# Altium project Sampling_Scope.PrjPcb (part 1 of 4)
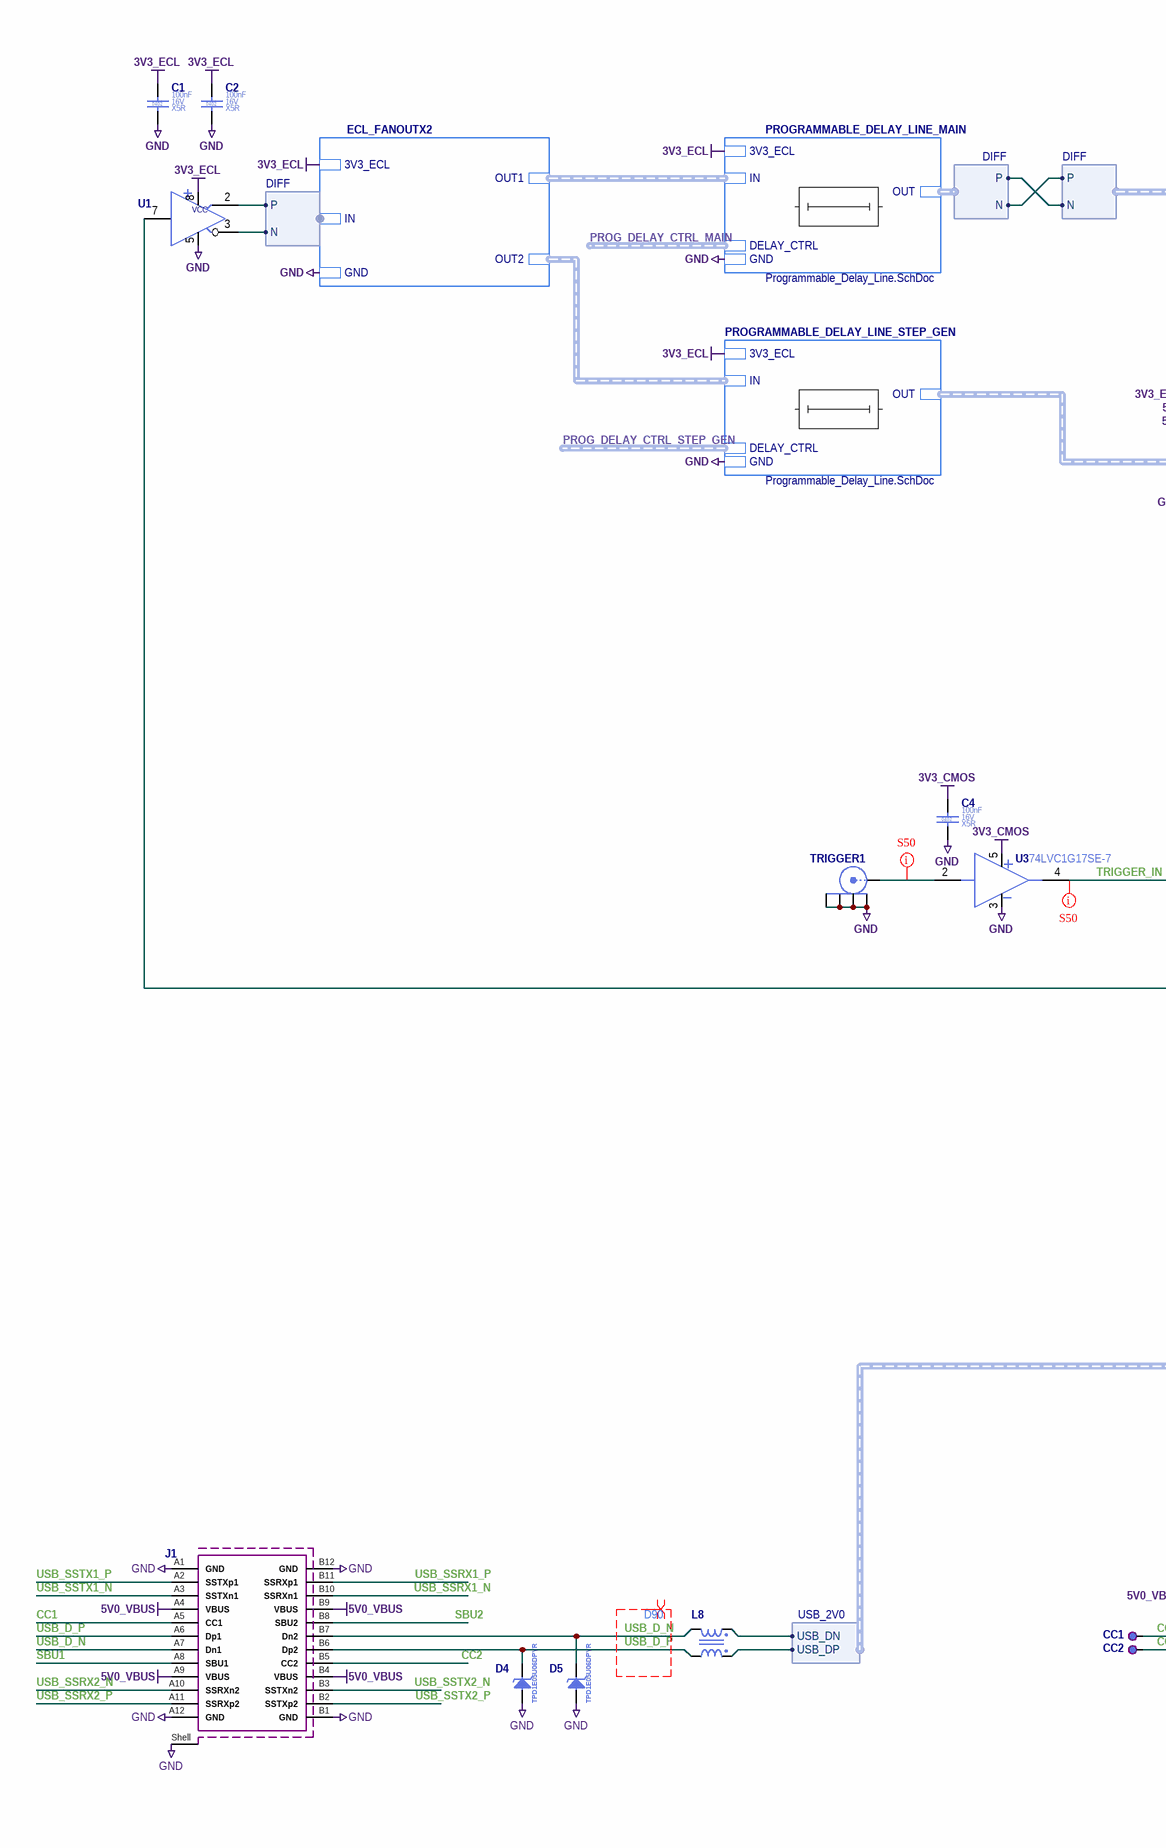
[diagram p0: Main.SchDoc, left]
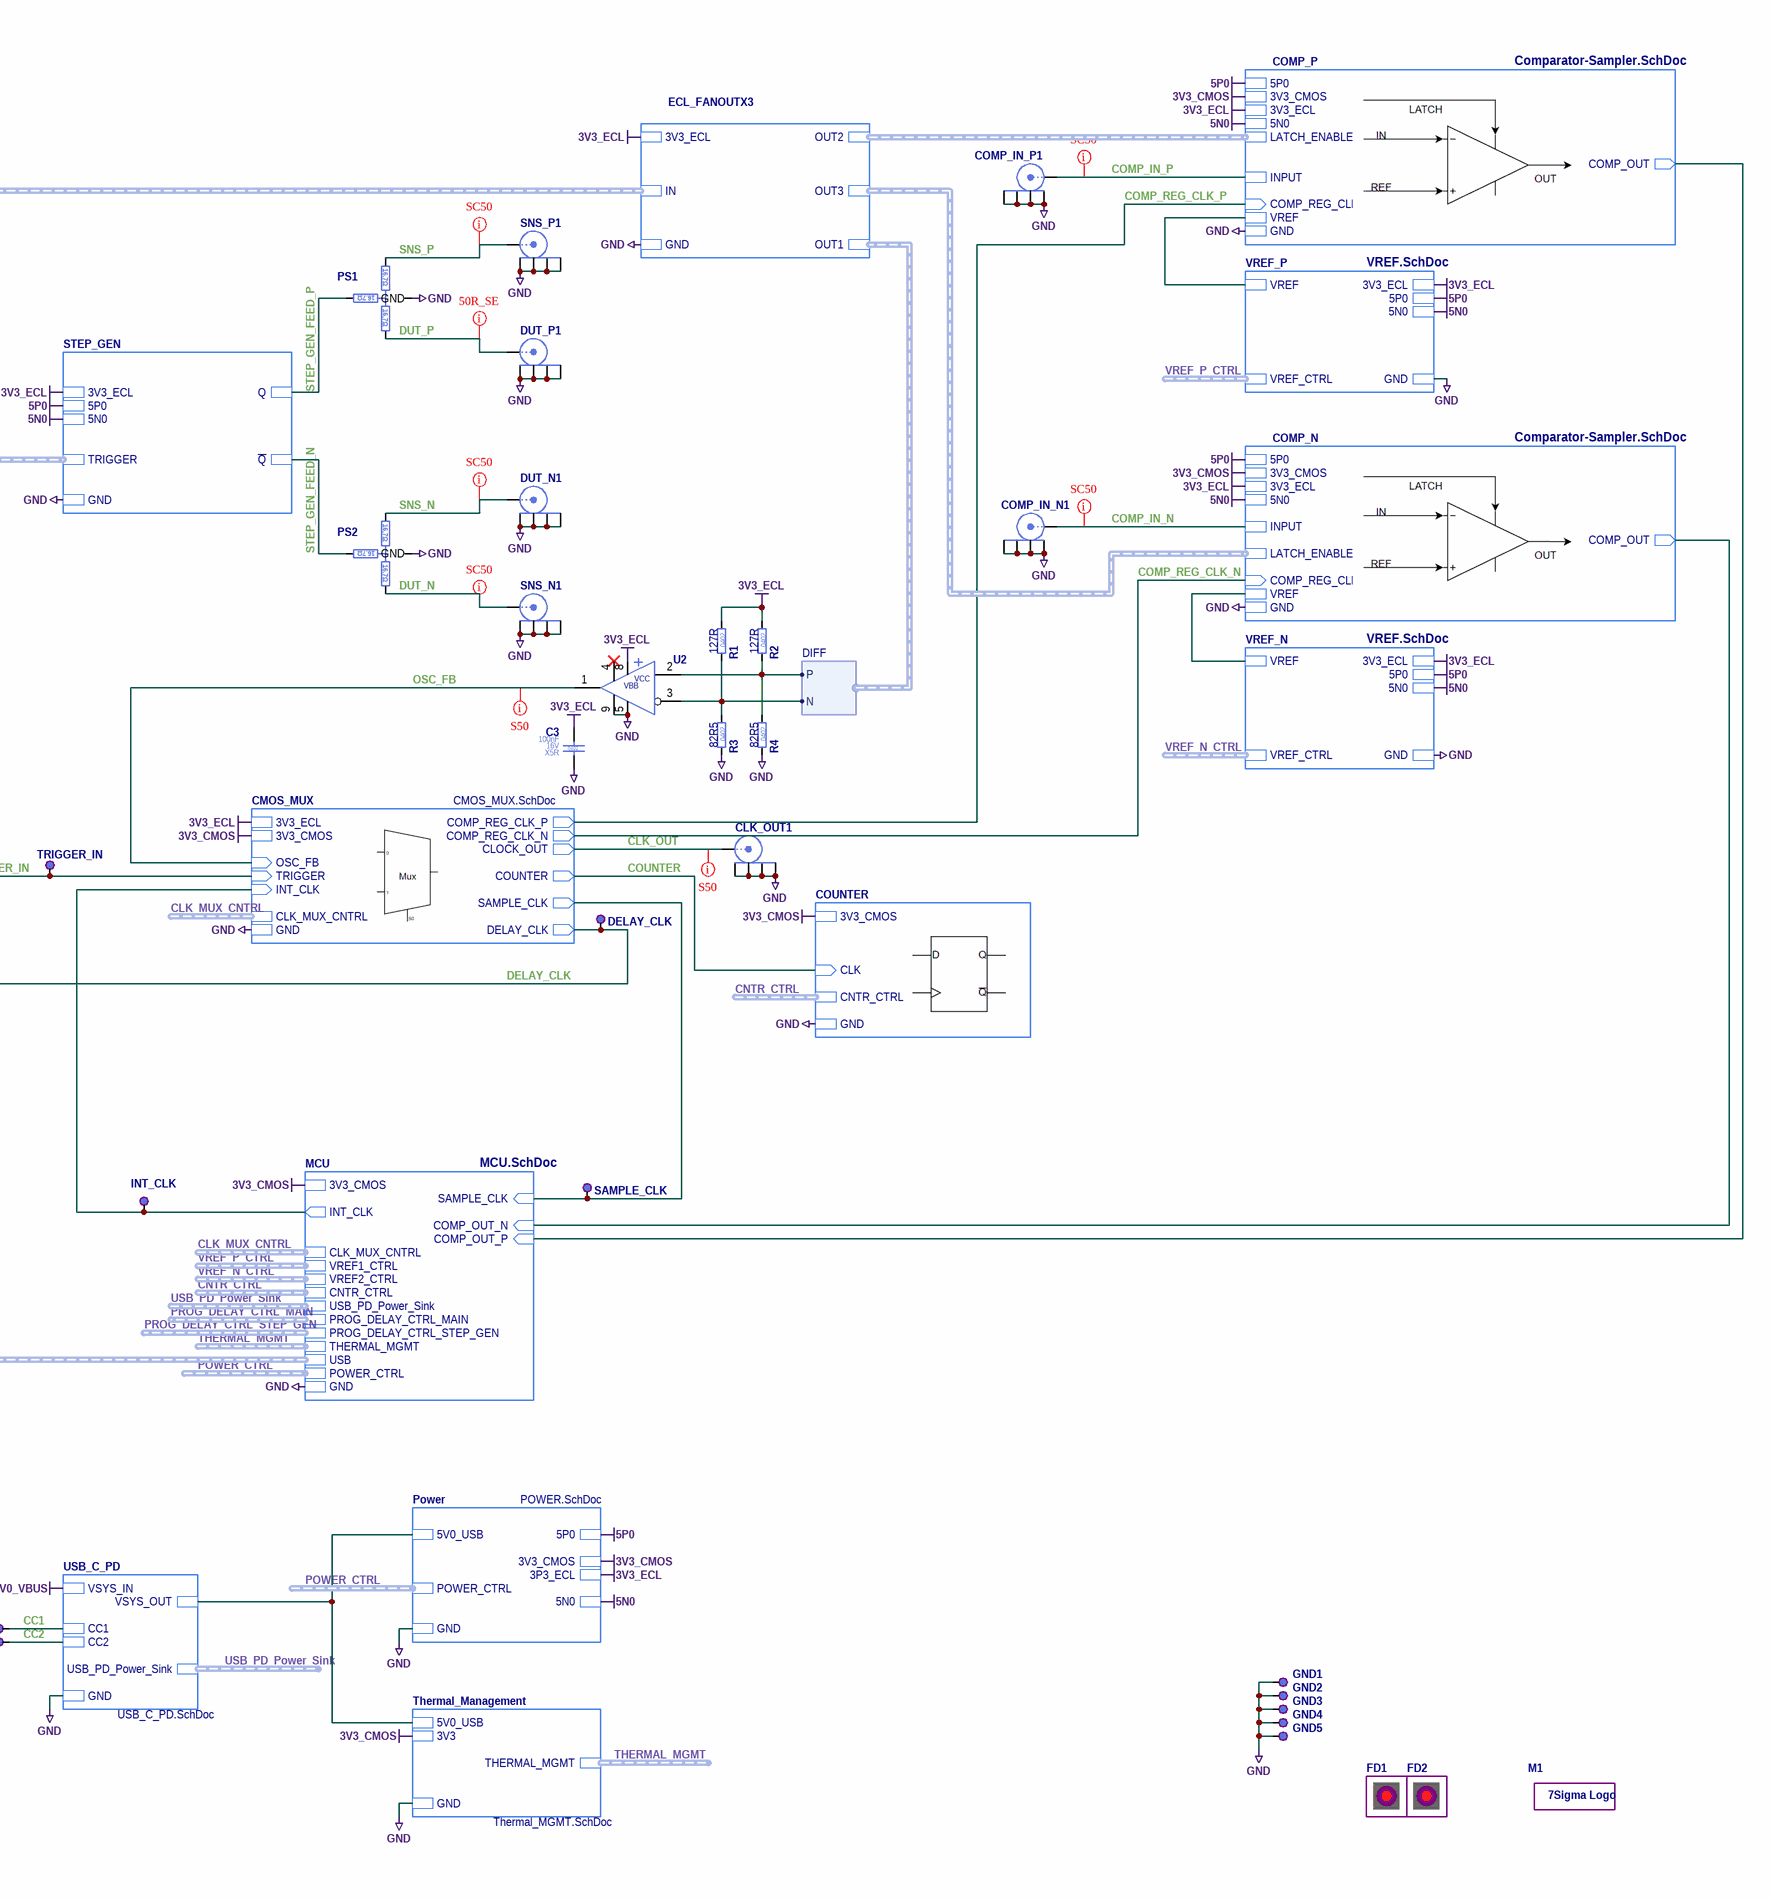
[diagram p1: Main.SchDoc, right]
17 sheets, 475 parts. Net scope: strictly hierarchical (ports join the sheet entries above them; power ports are local).
Board files: Sampling_Scope.PcbDoc, Sampling_Scope_Panel.PcbDoc
Sheets:
  Main.SchDoc
    VREF_P = VREF.SchDoc
      VREF_DAC = DAC_12bit.SchDoc
    COMP_P = Comparator-Sampler.SchDoc
    MCU = MCU.SchDoc
    Power = POWER.SchDoc
      LDO_ECL = 3V3_LDO.SchDoc
      LDO_CMOS = 3V3_LDO.SchDoc
      BUCK = 3V8_SWITCHER.SchDoc
      SIMO = SIMO_SWITCHER.SchDoc
    PROGRAMMABLE_DELAY_LINE_MAIN = Programmable_Delay_Line.SchDoc
      DELAY_DAC = DAC_12bit.SchDoc
    ECL_FANOUTX3 = ECL_Fanout_X3.SchDoc
    STEP_GEN = Step_Gen.SchDoc
    CMOS_MUX = CMOS_MUX.SchDoc
    COUNTER = Counter.SchDoc
    Thermal_Management = Thermal_MGMT.SchDoc
    VREF_N = VREF.SchDoc
      VREF_DAC = DAC_12bit.SchDoc
    COMP_N = Comparator-Sampler.SchDoc
    ECL_FANOUTX2 = ECL_Fanout_X2.SchDoc
    PROGRAMMABLE_DELAY_LINE_STEP_GEN = Programmable_Delay_Line.SchDoc
      DELAY_DAC = DAC_12bit.SchDoc
    USB_C_PD = USB_C_PD.SchDoc

## Sheet Main.SchDoc
size A2; ApprovedBy: Mateusz Kowalik; CheckedBy: Mateusz Kowalik; Author: Mateusz Kowalik; CompanyName: InMotion Labs sp. z o.o.; DrawnBy: Mateusz Kowalik; Engineer: Mateusz Kowalik; Organization: InMotion Labs sp. z o.o.; Address1: Rydlówka 5A; Address2: 30-363 Kraków; Address4: Poland; DocumentNumber: 1; Revision: Rev 0; SheetNumber: 1; SheetTotal: 17

### Parts
C1  Case/Package: 0402  Voltage Rating (DC): 16V  Dielectric: X5R  Capacitance: 100nF  [C_0402_1005]  (hidden comment: C_100NF_16V_X5R_0402_10)
C2  Case/Package: 0402  Voltage Rating (DC): 16V  Dielectric: X5R  Capacitance: 100nF  [C_0402_1005]  (hidden comment: C_100NF_16V_X5R_0402_10)
C3  Case/Package: 0402  Voltage Rating (DC): 16V  Dielectric: X5R  Capacitance: 100nF  [C_0402_1005]  (hidden comment: C_100NF_16V_X5R_0402_10)
C4  Case/Package: 0402  Voltage Rating (DC): 16V  Dielectric: X5R  Capacitance: 100nF  [C_0402_1005]  (hidden comment: C_100NF_16V_X5R_0402_10)
CC1  TP_PAD_1.3MM  [TP_PAD_1.3MM]  (value not drawn)  (no BOM)
CC2  TP_PAD_1.3MM  [TP_PAD_1.3MM]  (value not drawn)  (no BOM)
CLK_OUT1  60312202111527  [60312202111527]  (value not drawn)
COMP_IN_N1  60312202111527  [60312202111527]  (value not drawn)
COMP_IN_P1  60312202111527  [60312202111527]  (value not drawn)
D4  TPD1E05U06DPYR  [DFN100X60X40-2N]
D5  TPD1E05U06DPYR  [DFN100X60X40-2N]
DELAY_CLK  TP_PAD_1.3MM  [TP_PAD_1.3MM]  (value not drawn)  (no BOM)
DUT_N1  60312202111527  [60312202111527]  (value not drawn)
DUT_P1  60312202111527  [60312202111527]  (value not drawn)
FD1  FIDUCIAL  [FID]  (value not drawn)  (no BOM)
FD2  FIDUCIAL  [FID]  (value not drawn)  (no BOM)
GND1  5016  [5016]  (value not drawn)  (no BOM)
GND2  5016  [5016]  (value not drawn)  (no BOM)
GND3  5016  [5016]  (value not drawn)  (no BOM)
GND4  5016  [5016]  (value not drawn)  (no BOM)
GND5  5016  [5016]  (value not drawn)  (no BOM)
INT_CLK  TP_PAD_1.3MM  [TP_PAD_1.3MM]  (value not drawn)  (no BOM)
J1  632723100011  [632723100011]  (value not drawn)
L8  744231091  [L_0805_COMMON_MODE]  (value not drawn)
M1  7Sigma  [7Sigma]  (value not drawn)  (no BOM)
PS1  PS1608GT2-R50-T1  [PS1608G]  (value not drawn)
PS2  PS1608GT2-R50-T1  [PS1608G]  (value not drawn)
R1  Resistance: 127R  Case/Package: 0402  [R_0402_1005]  (hidden comment: R_127R_0402_1)
R2  Resistance: 127R  Case/Package: 0402  [R_0402_1005]  (hidden comment: R_127R_0402_1)
R3  Resistance: 82R5  Case/Package: 0402  [R_0402_1005]  (hidden comment: R_82R5_0402_1)
R4  Resistance: 82R5  Case/Package: 0402  [R_0402_1005]  (hidden comment: R_82R5_0402_1)
SAMPLE_CLK  TP_PAD_1.3MM  [TP_PAD_1.3MM]  (value not drawn)  (no BOM)
SNS_N1  60312202111527  [60312202111527]  (value not drawn)
SNS_P1  60312202111527  [60312202111527]  (value not drawn)
TRIGGER1  60312202111527  [60312202111527]  (value not drawn)
TRIGGER_IN  TP_PAD_1.3MM  [TP_PAD_1.3MM]  (value not drawn)  (no BOM)
U1  MC100LVELT20DG  [SOIC127P600X170-8N]  (value not drawn)
U2  MC100EPT21MNR4G  [SON50P200X80_HS-9N]  (value not drawn)
U3  74LVC1G17SE-7  [SC70-5_SOT353_TSSOP5]

### Sub-sheets
CMOS_MUX = CMOS_MUX.SchDoc: 3V3_ECL, INT_CLK (in), CLK_MUX_CNTRL (harness CLK_MUX_CTRL), SAMPLE_CLK (out), 3V3_CMOS, CLOCK_OUT (out), GND, OSC_FB (in), DELAY_CLK (out), TRIGGER (in), COMP_REG_CLK_P (out), COUNTER (out), COMP_REG_CLK_N (out)
COMP_N = Comparator-Sampler.SchDoc: INPUT, COMP_OUT (out), VREF, LATCH_ENABLE (harness DIFF), 5N0, 3V3_ECL, GND, 3V3_CMOS, 5P0, COMP_REG_CLK (in)
COMP_P = Comparator-Sampler.SchDoc: INPUT, COMP_OUT (out), VREF, LATCH_ENABLE (harness DIFF), 5N0, 3V3_ECL, GND, 3V3_CMOS, 5P0, COMP_REG_CLK (in)
COUNTER = Counter.SchDoc: CLK (in), GND, CNTR_CTRL (harness CNTR_CTRL), 3V3_CMOS
ECL_FANOUTX2 = ECL_Fanout_X2.SchDoc: GND, 3V3_ECL, IN (harness DIFF), OUT1 (harness DIFF), OUT2 (harness DIFF)
ECL_FANOUTX3 = ECL_Fanout_X3.SchDoc: GND, 3V3_ECL, OUT3 (harness DIFF), IN (harness DIFF), OUT1 (harness DIFF), OUT2 (harness DIFF)
MCU = MCU.SchDoc: COMP_OUT_P (in), SAMPLE_CLK (in), INT_CLK (out), 3V3_CMOS, GND, CLK_MUX_CNTRL (harness CLK_MUX_CTRL), VREF1_CTRL (harness DAC), CNTR_CTRL, VREF2_CTRL (harness DAC), COMP_OUT_N (in), PROG_DELAY_CTRL_MAIN, PROG_DELAY_CTRL_STEP_GEN, THERMAL_MGMT, USB (harness USB_2V0), POWER_CTRL (harness POWER_CTRL), USB_PD_Power_Sink
Power = POWER.SchDoc: 3P3_ECL, 3V3_CMOS, GND, 5N0, 5V0_USB, 5P0, POWER_CTRL
PROGRAMMABLE_DELAY_LINE_MAIN = Programmable_Delay_Line.SchDoc: DELAY_CTRL (harness DELAY), GND, IN (harness DIFF), 3V3_ECL, OUT (harness DIFF)
PROGRAMMABLE_DELAY_LINE_STEP_GEN = Programmable_Delay_Line.SchDoc: DELAY_CTRL (harness DELAY), GND, IN (harness DIFF), 3V3_ECL, OUT (harness DIFF)
STEP_GEN = Step_Gen.SchDoc: GND, 3V3_ECL, TRIGGER (harness DIFF), 5N0, 5P0, ~{Q}, Q
Thermal_Management = Thermal_MGMT.SchDoc: 5V0_USB, GND, 3V3, THERMAL_MGMT (harness THERMAL_MGMT)
USB_C_PD = USB_C_PD.SchDoc: CC2, VSYS_OUT, VSYS_IN, GND, CC1, USB_PD_Power_Sink (harness USB_PD_Power_Sink)
VREF_N = VREF.SchDoc: VREF_CTRL (harness DAC), VREF, 3V3_ECL, 5N0, GND, 5P0
VREF_P = VREF.SchDoc: VREF_CTRL (harness DAC), VREF, 3V3_ECL, 5N0, GND, 5P0

### Harnesses
DIFF: P, N
USB_2V0: USB_DN, USB_DP

### Nets
3V3_CMOS: C4.1 U3.5(VCC) ; sheet COMP_P/3V3_CMOS, sheet MCU/3V3_CMOS, sheet Power/3V3_CMOS, sheet CMOS_MUX/3V3_CMOS, sheet COUNTER/3V3_CMOS, sheet Thermal_Management/3V3, sheet COMP_N/3V3_CMOS
3V3_ECL: C1.1 C2.1 C3.1 R1.2 R2.2 U1.8(VCC) U2.8(VDD) ; sheet VREF_P/3V3_ECL, sheet COMP_P/3V3_ECL, sheet Power/3P3_ECL, sheet PROGRAMMABLE_DELAY_LINE_MAIN/3V3_ECL, sheet ECL_FANOUTX3/3V3_ECL, sheet STEP_GEN/3V3_ECL, sheet CMOS_MUX/3V3_ECL, sheet VREF_N/3V3_ECL, sheet COMP_N/3V3_ECL, sheet ECL_FANOUTX2/3V3_ECL, sheet PROGRAMMABLE_DELAY_LINE_STEP_GEN/3V3_ECL
5N0: sheet VREF_P/5N0, sheet COMP_P/5N0, sheet Power/5N0, sheet STEP_GEN/5N0, sheet VREF_N/5N0, sheet COMP_N/5N0
5P0: sheet VREF_P/5P0, sheet COMP_P/5P0, sheet Power/5P0, sheet STEP_GEN/5P0, sheet VREF_N/5P0, sheet COMP_N/5P0
5V0_USB: sheet Power/5V0_USB, sheet Thermal_Management/5V0_USB, sheet USB_C_PD/VSYS_OUT
5V0_VBUS: J1.A4(VBUS) J1.A9(VBUS) J1.B4(VBUS) J1.B9(VBUS) ; sheet USB_C_PD/VSYS_IN
GND: C1.2 C2.2 C3.2 C4.2 CLK_OUT1.2(Y) CLK_OUT1.3(Y) CLK_OUT1.4(Y) CLK_OUT1.5(Y) COMP_IN_N1.2(Y) COMP_IN_N1.3(Y) COMP_IN_N1.4(Y) COMP_IN_N1.5(Y) COMP_IN_P1.2(Y) COMP_IN_P1.3(Y) COMP_IN_P1.4(Y) COMP_IN_P1.5(Y) D4.2(A) D5.2(A) DUT_N1.2(Y) DUT_N1.3(Y) DUT_N1.4(Y) DUT_N1.5(Y) DUT_P1.2(Y) DUT_P1.3(Y) DUT_P1.4(Y) DUT_P1.5(Y) GND1.1(TP) GND2.1(TP) GND3.1(TP) GND4.1(TP) GND5.1(TP) J1.A1(GND) J1.A12(GND) J1.B1(GND) J1.B12(GND) J1.Shell(Shield) PS1.4(GND) PS2.4(GND) R3.1 R4.1 SNS_N1.2(Y) SNS_N1.3(Y) SNS_N1.4(Y) SNS_N1.5(Y) SNS_P1.2(Y) SNS_P1.3(Y) SNS_P1.4(Y) SNS_P1.5(Y) TRIGGER1.2(Y) TRIGGER1.3(Y) TRIGGER1.4(Y) TRIGGER1.5(Y) U1.5(VSS) U2.5(VSS) U2.9(VSS) U3.3(GND) ; sheet VREF_P/GND, sheet COMP_P/GND, sheet MCU/GND, sheet Power/GND, sheet PROGRAMMABLE_DELAY_LINE_MAIN/GND, sheet ECL_FANOUTX3/GND, sheet STEP_GEN/GND, sheet CMOS_MUX/GND, sheet COUNTER/GND, sheet Thermal_Management/GND, sheet VREF_N/GND, sheet COMP_N/GND, sheet ECL_FANOUTX2/GND, sheet PROGRAMMABLE_DELAY_LINE_STEP_GEN/GND, sheet USB_C_PD/GND
CC1: CC1.1(TP) J1.A5(CC1) ; sheet USB_C_PD/CC1
CC2: CC2.1(TP) J1.B5(CC2) ; sheet USB_C_PD/CC2
CLK_OUT: CLK_OUT1.1(X) ; sheet CMOS_MUX/CLOCK_OUT
COMP_IN_N: COMP_IN_N1.1(X) ; sheet COMP_N/INPUT
COMP_IN_P: COMP_IN_P1.1(X) ; sheet COMP_P/INPUT
COMP_OUT_N: sheet COMP_P/COMP_OUT, sheet MCU/COMP_OUT_P
COMP_OUT_P: sheet MCU/COMP_OUT_N, sheet COMP_N/COMP_OUT
COMP_REG_CLK_N: sheet CMOS_MUX/COMP_REG_CLK_N, sheet COMP_N/COMP_REG_CLK
COMP_REG_CLK_P: sheet COMP_P/COMP_REG_CLK, sheet CMOS_MUX/COMP_REG_CLK_P
COUNTER: sheet CMOS_MUX/COUNTER, sheet COUNTER/CLK
DELAY_CLK: DELAY_CLK.1(TP) U1.7(D) ; sheet CMOS_MUX/DELAY_CLK
DELAY_OUT1_N: sheet PROGRAMMABLE_DELAY_LINE_MAIN/OUT.N, sheet ECL_FANOUTX3/IN.P
DELAY_OUT1_P: sheet PROGRAMMABLE_DELAY_LINE_MAIN/OUT.P, sheet ECL_FANOUTX3/IN.N
DUT_N: PS2.3(OUT2) SNS_N1.1(X)  [project net DUT_N_1]
DUT_P: DUT_P1.1(X) PS1.3(OUT2)  [project net DUT_P_1]
IN_N: U1.3(~{Q}) ; sheet ECL_FANOUTX2/IN.N
IN_P: U1.2(Q) ; sheet ECL_FANOUTX2/IN.P
INT_CLK: INT_CLK.1(TP) ; sheet MCU/INT_CLK, sheet CMOS_MUX/INT_CLK
OSC_FB: U2.1(OUTA) ; sheet CMOS_MUX/OSC_FB
OUT1_N: R1.1 R3.2 U2.3(~{D}) ; sheet ECL_FANOUTX3/OUT1.N
OUT1_P: R2.1 R4.2 U2.2(D) ; sheet ECL_FANOUTX3/OUT1.P
SAMPLE_CLK: SAMPLE_CLK.1(TP) ; sheet MCU/SAMPLE_CLK, sheet CMOS_MUX/SAMPLE_CLK
SBU1: J1.A8(SBU1)  [project net SBU1_1]
SBU2: J1.B8(SBU2)  [project net SBU2_1]
SNS_N: DUT_N1.1(X) PS2.2(OUT1)  [project net SNS_N_1]
SNS_P: PS1.2(OUT1) SNS_P1.1(X)  [project net SNS_P_1]
STEP_GEN_FEED_N: PS2.1(IN) ; sheet STEP_GEN/~{Q}
STEP_GEN_FEED_P: PS1.1(IN) ; sheet STEP_GEN/Q
TRIGGER_IN: TRIGGER_IN.1(TP) U3.4(Y) ; sheet CMOS_MUX/TRIGGER
USB_D_N: D5.1(C) J1.A7(Dn1) J1.B7(Dn2) L8.2  [project net USB_D_N_1]
USB_D_N: L8.1 ; sheet MCU/USB.USB_DN  [a separate net that carries the same name]
USB_D_P: D4.1(C) J1.A6(Dp1) J1.B6(Dp2) L8.3  [project net USB_D_P_1]
USB_D_P: L8.4 ; sheet MCU/USB.USB_DP  [a separate net that carries the same name]
USB_SSRX1_N: J1.B10(SSRXn1)  [project net USB_SSRX1_N_1]
USB_SSRX1_P: J1.B11(SSRXp1)  [project net USB_SSRX1_P_1]
USB_SSRX2_N: J1.A10(SSRXn2)  [project net USB_SSRX2_N_1]
USB_SSRX2_P: J1.A11(SSRXp2)  [project net USB_SSRX2_P_1]
USB_SSTX1_N: J1.A3(SSTXn1)  [project net USB_SSTX1_N_1]
USB_SSTX1_P: J1.A2(SSTXp1)  [project net USB_SSTX1_P_1]
USB_SSTX2_N: J1.B3(SSTXn2)  [project net USB_SSTX2_N_1]
USB_SSTX2_P: J1.B2(SSTXp2)  [project net USB_SSTX2_P_1]
NetC8_COMP_N_1: sheet VREF_N/VREF, sheet COMP_N/VREF
NetC8_COMP_P_1: sheet VREF_P/VREF, sheet COMP_P/VREF
NetTRIGGER1_1: TRIGGER1.1(X) U3.2(A)

Not connected (* = marked no-connect by the designer): U1 1(NC) 4(NC) 6(NC); U2 4(VDD)*

### Buses and harness runs
harness CLK_MUX_CNTRL = sheet CMOS_MUX/CLK_MUX_CNTRL
harness CLK_MUX_CNTRL = sheet MCU/CLK_MUX_CNTRL
harness CNTR_CTRL = sheet COUNTER/CNTR_CTRL
harness CNTR_CTRL = sheet MCU/CNTR_CTRL
harness POWER_CTRL = sheet MCU/POWER_CTRL
harness POWER_CTRL = sheet Power/POWER_CTRL
harness PROG_DELAY_CTRL_MAIN = sheet MCU/PROG_DELAY_CTRL_MAIN
harness PROG_DELAY_CTRL_MAIN = sheet PROGRAMMABLE_DELAY_LINE_MAIN/DELAY_CTRL
harness PROG_DELAY_CTRL_STEP_GEN = sheet MCU/PROG_DELAY_CTRL_STEP_GEN
harness PROG_DELAY_CTRL_STEP_GEN = sheet PROGRAMMABLE_DELAY_LINE_STEP_GEN/DELAY_CTRL
harness sheet COMP_N/LATCH_ENABLE = sheet ECL_FANOUTX3/OUT3
harness sheet COMP_P/LATCH_ENABLE = sheet ECL_FANOUTX3/OUT2
harness sheet ECL_FANOUTX2/OUT1 = sheet PROGRAMMABLE_DELAY_LINE_MAIN/IN
harness sheet ECL_FANOUTX2/OUT2 = sheet PROGRAMMABLE_DELAY_LINE_STEP_GEN/IN
harness sheet PROGRAMMABLE_DELAY_LINE_STEP_GEN/OUT = sheet STEP_GEN/TRIGGER
harness THERMAL_MGMT = sheet MCU/THERMAL_MGMT
harness THERMAL_MGMT = sheet Thermal_Management/THERMAL_MGMT
harness USB_PD_Power_Sink = sheet MCU/USB_PD_Power_Sink
harness USB_PD_Power_Sink = sheet USB_C_PD/USB_PD_Power_Sink
harness VREF_N_CTRL = sheet MCU/VREF2_CTRL
harness VREF_N_CTRL = sheet VREF_N/VREF_CTRL
harness VREF_P_CTRL = sheet MCU/VREF1_CTRL
harness VREF_P_CTRL = sheet VREF_P/VREF_CTRL

### Layout directives
net class SC50: DUT_N_1, DUT_P_1, SNS_N_1, SNS_P_1
net class S50: CLK_OUT, NetTRIGGER1_1, OSC_FB, TRIGGER_IN
net class SC50; net class COMP_IN: COMP_IN_N, COMP_IN_P
differential pair; differential pair class D90: USB_D_N, USB_D_P

### Notes on the sheet
- Title
- Size:
- Date:
- A2
- (in symbol 7Sigma) 7Sigma Logo
- (in symbol MC100EPT21MNR4G) VCC; VBB
- (in symbol PS1608GT2-R50-T1) 16.7Ω

### Library data of the parts
C1-C4 = C_100NF_16V_X5R_0402_10: Ceramic Capacitor; Manufacturer Part Number: EMK105BJ104KV-F; Manufacturer: Taiyo Yuden; Value: 100nF; Tolerance: 10%; Part Number: C_100NF_16V_X5R_0402_10; Mount: Surface Mount; Height: 500um; HelpURL: http://datasheet.octopart.com/EMK105BJ104KV-F-Taiyo-Yuden-datasheet-8857305.pdf; RoHS: Compliant; Max Operating Temperature: 125°C; Status: MK; Supplier 1: Mouser; Supplier Part Number 1: 963-EMK105BJ104KV-F; Manufacturer 2: Samsung Electro-Mechanics; Manufacturer Part Number 2: CL05B104KO5NNNC; Supplier 2: LCSC; Supplier Part Number 2: C1525
CC1 CC2 DELAY_CLK INT_CLK SAMPLE_CLK TRIGGER_IN = TP_PAD_1.3MM: Testpoint SMD 1.3mm; Part Number: TP_PAD_1.3MM; Case/Package: SMD; Length: 0mm
CLK_OUT1 COMP_IN_N1 COMP_IN_P1 DUT_N1 DUT_P1 SNS_N1 SNS_P1 TRIGGER1 = 60312202111527: SMA Connector; Manufacturer: Wurth Electronics; Gender: Female; Max Frequency: 18GHz; Box: T1; Manufacturer Part Number: 60312202111527; Part Number: 60312202111527; Mount: SMD; Height: 6.35mm; HelpURL: https://www.we-online.com/catalog/datasheet/60312202111527.pdf; Lead Free: Lead Free; Length: 13.33mm; Number of Pins: 3; Orientation: Vertical; RoHS: Compliant; Stock: 3
D4 D5 = TPD1E05U06DPYR: 1 Channel ESD Protection Device for Super-Speed (Up to 6 Gbps); Manufacturer: Texas Instruments; Capacitance: 0.5pF; Max Power Dissipation: 40W; Direction: Unidirectional; Max Breakdown Voltage: 5.5V; Min Breakdown Voltage: 6V; Box: 79; Part Number: TPD1E05U06DPYR; Case/Package: 0402; Manufacturer Part Number: TPD1E05U06DPYR; Mount: Surface Mount; HelpURL: https://www.ti.com/lit/ds/symlink/tpd1e05u06.pdf?ts=1594570399510&ref_url=https%253A%252F%252Fwww.ti.com%252Fproduct%252FTPD1E05U06; Working Voltage: 5.5V; Max Operating Temperature: 125°C; RoHS: Compliant; Height: 0.35mm; Status: MK; Supplier 1: Mouser; Supplier Part Number 1: 595-TPD1E05U06DPYR; Stock: 56
GND1-GND5 = 5016: Test Point; Micro Mini; SMT; Phos Bronze/Silver; Manufacturer: Keystone Electronics; Number of Ports: 1; Part Number: 5016; Case/Package: SMD; Mount: Surface Mount; Height: 0.09inch; HelpURL: https://pl.mouser.com/datasheet/2/215/016-743689.pdf; Lead Free: Lead Free; Length: 3.81mm; Number of Pins: 1; REACH SVHC: No SVHC; RoHS: Compliant; Termination: Solder; Manufacturer Part Number: 5016; Supplier 1: Mouser; Supplier Part Number 1: 534-5016
J1 = 632723100011: WR-COM USB 3.1 Type C Receptacle Horizontal THT / SMT; Manufacturer: Wurth Electronics; Box: G5; Part Number: 632723100011; Manufacturer Part Number: 632723100011; Mount: Surface Mount,Through Hole; Number of Pins: 24; Orientation: Horizontal; HelpURL: https://pl.mouser.com/datasheet/2/445/632723x00011(3)-782157.pdf; Max Operating Temperature: 105C; RoHS: Compilant; Stock: 13
L8 = 744231091: Common Mode Line Filter; Manufacturer: Wurth Elektronik; Inductance: 131nH; DC Current: 370mA; DC Resistance: 300m; Box: 72; Part Number: 744231091; Manufacturer Part Number: 744231091; Case/Package: 0805; Mount: Surface Mount; Height: 1.2mm; HelpURL: https://www.we-online.com/catalog/datasheet/744231091.pdf; Max Operating Temperature: 125; Status: MK; RoHS: Compliant; Stock: 22
M1 = 7Sigma: 7Sigma Marking; Part Number: 7Sigma; Status: MK
PS1 PS2 = PS1608GT2-R50-T1: 20GHz Resistive Power Splitter; Manufacturer: Susumu; Impedance: 50Ohm; Manufacturer Part Number: PS1608GT2-R50-T1; Part Number: PS1608GT2-R50-T1; Mount: Surface Mount; Frequency: 20GHz; Height: 400um; HelpURL: https://pl.mouser.com/datasheet/2/392/n_catalog_partition31_en-1660522.pdf; Max Operating Temperature: 125; Min Operating Temperature: -40; Status: MK; RoHS: Compliant
R1 R2 = R_127R_0402_1: Thick Film Resistor; Manufacturer: Yageo; Manufacturer Part Number: RC0402FR-07127RL; Value: 127R; Tolerance: 1%; Voltage Rating (DC): 50V; Power Rating: 63mW; Stats: MK; Part Number: R_127R_0402_1; Mount: Surface Mount; Height: 350um; HelpURL: https://pl.mouser.com/datasheet/2/447/PYu_RC_Group_51_RoHS_L_10-1664068.pdf; RoHS: Compliant; Max Operating Temperature: 155°C; Supplier 1: Mouser; Supplier Part Number 1: 603-RC0402FR-07127RL; Manufacturer 2: Uniroyal Elec; Manufacturer Part Number 2: 0402WGF1270TCE; Supplier 2: LCSC; Supplier Part Number 2: C247127
R3 R4 = R_82R5_0402_1: Thick Film Resistor; Manufacturer: Yageo; Manufacturer Part Number: RC0402FR-0782R5L; Value: 82R5; Tolerance: 1%; Voltage Rating (DC): 50V; Power Rating: 63mW; Stats: MK; Part Number: R_82R5_0402_1; Mount: Surface Mount; Height: 350um; HelpURL: https://pl.mouser.com/datasheet/2/447/PYu-RC_Group_51_RoHS_L_10-1527934.pdf; RoHS: Compliant; Max Operating Temperature: 155°C; Supplier 1: Mouser; Supplier Part Number 1: 603-RC0402FR-0782R5L; Manufacturer 2: Uniroyal Elec; Manufacturer Part Number 2: 0402WGF825JTCE; Supplier 2: LCSC; Supplier Part Number 2: C52037
U1 = MC100LVELT20DG: LVTTL/LVCMOS to Differential LVPECL Translator; Manufacturer: ON Semiconductor; Output Current: 100mA; Marking: KVT20; Max Supply Voltage: 3.6V; Min Supply Voltage: 3V; Part Number: MC100LVELT20DG; Case/Package: SOIC8; Max Output Current: 100mA; Mount: Surface Mount; Height: 1.75mm; HelpURL: https://pl.mouser.com/datasheet/2/308/MC100LVELT20_D-1811115.pdf; Max Operating Temperature: 85°C; RoHS: Compliant; Status: MK; Manufacturer Part Number: MC100LVELT20DG; Supplier 1: Mouser; Supplier Part Number 1: 863-MC100LVELT20DG
U2 = MC100EPT21MNR4G: Differential LVPECL/LVDS/CML to LVTTL/LVCMOS Translator; Manufacturer: ON Semiconductor; Output Current: 24mA; Marking: 3RM; Max Supply Voltage: 3.8V; Min Supply Voltage: 3.3V; Part Number: MC100EPT21MNR4G; Case/Package: DFN-8; Max Output Current: 24mA; Mount: Surface Mount; Height: 1mm; HelpURL: https://datasheet.octopart.com/MC100EPT21MNR4G-ON-Semiconductor-datasheet-12520234.pdf; Max Operating Temperature: 85°C; RoHS: Compliant; Status: MK; Manufacturer Part Number: MC100EPT21MNR4G; Supplier 1: Mouser; Supplier Part Number 1: 863-MC100EPT21MNR4G
U3 = 74LVC1G17SE-7: Schmitt Buffer; Manufacturer: Diodes Incorporated; Output Current: 24mA; Marking: UR; Max Supply Voltage: 5.5V; Min Supply Voltage: 1.65V; Manufacturer Part Number: 74LVC1G17SE-7; Part Number: 74LVC1G17SE-7; Case/Package: SOT-353; Max Output Current: 24mA; Mount: Surface Mount; HelpURL: https://datasheet.octopart.com/74LVC1G17SE-7-Diodes-Inc.-datasheet-46750521.pdf; Max Operating Temperature: 125°C; RoHS: Compliant; Status: MK; Supplier 1: Mouser; Supplier Part Number 1: 621-74LVC1G17SE-7
FD1 FD2 = FIDUCIAL: Part Number: FIDUCIAL; Status: MK

## Sheet VREF.SchDoc
size A4; ApprovedBy: Mateusz Kowalik; CheckedBy: Mateusz Kowalik; Author: Mateusz Kowalik; CompanyName: InMotion Labs sp. z o.o.; DrawnBy: Mateusz Kowalik; Engineer: Mateusz Kowalik; Organization: InMotion Labs sp. z o.o.; Address1: Rydlówka 5A; Address2: 30-363 Kraków; Address4: Poland; DocumentNumber: 11; Revision: Rev 0; SheetNumber: 11; SheetTotal: 17
Used 2 times, as channels VREF_P, VREF_N. Parts and nets are listed once, with the designators drawn on the sheet.
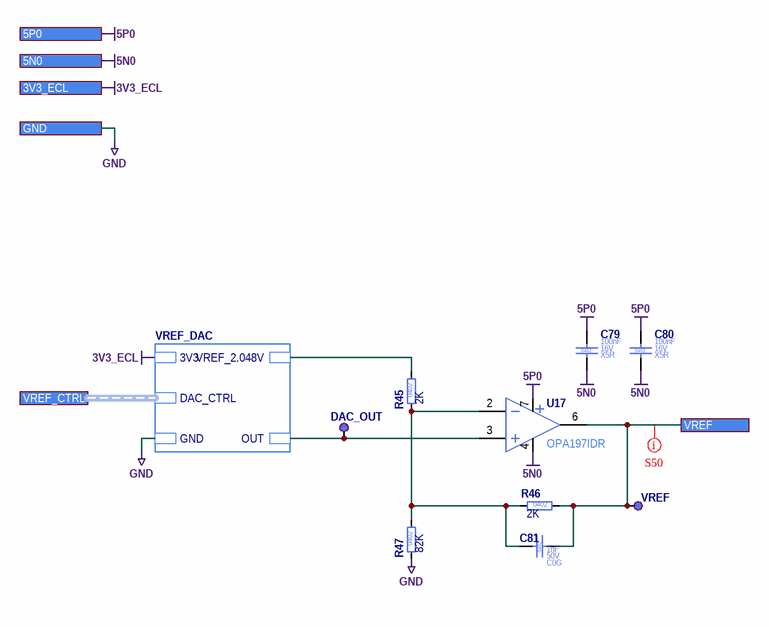
[diagram p2: VREF.SchDoc]

### Parts
C79  Case/Package: 0402  Voltage Rating (DC): 16V  Dielectric: X5R  Capacitance: 100nF  [C_0402_1005]  (hidden comment: C_100NF_16V_X5R_0402_10)
C80  Case/Package: 0402  Voltage Rating (DC): 16V  Dielectric: X5R  Capacitance: 100nF  [C_0402_1005]  (hidden comment: C_100NF_16V_X5R_0402_10)
C81  Case/Package: 0402  Voltage Rating (DC): 50V  Dielectric: C0G  Capacitance: 1nF  [C_0402_1005]  (hidden comment: C_1NF_50V_C0G_0402_5)
DAC_OUT  TP_PAD_1.3MM  [TP_PAD_1.3MM]  (value not drawn)  (no BOM)
R45  Resistance: 2K  Case/Package: 0402  [R_0402_1005]  (hidden comment: R_2K_0402_1)
R46  Resistance: 2K  Case/Package: 0402  [R_0402_1005]  (hidden comment: R_2K_0402_1)
R47  Resistance: 82K  Case/Package: 0402  [R_0402_1005]  (hidden comment: R_82K_0402_1)
U17  OPA197IDR  [SOIC127P600X170-8N]
VREF  TP_PAD_1.3MM  [TP_PAD_1.3MM]  (value not drawn)  (no BOM)

### Sub-sheets
VREF_DAC = DAC_12bit.SchDoc: 3V3, DAC_CTRL (harness DAC), VREF_2.048V, OUT, GND

### Ports
3V3_ECL, 5N0, 5P0, GND, VREF, VREF_CTRL (harness DAC)

### Nets
3V3_ECL: port 3V3_ECL, sheet VREF_DAC/3V3
5N0: C79.2 C80.2 U17.4(VSS) ; port 5N0
5P0: C79.1 C80.1 U17.7(VDD) ; port 5P0
GND: R47.1 ; port GND, sheet VREF_DAC/GND
VREF: C81.2 R46.2 U17.6(OUTA) VREF.1(TP) ; port VREF
NetC81_1: C81.1 R45.1 R46.1 R47.2 U17.2(INA-)
NetDAC_OUT_1: DAC_OUT.1(TP) U17.3(INA+) ; sheet VREF_DAC/OUT
NetR45_2: R45.2 ; sheet VREF_DAC/VREF_2.048V

Not connected (* = marked no-connect by the designer): U17 1(NC) 5(NC) 8(NC)

### Channels
VREF_P: designators end in _VREF_P; ports 3V3_ECL=3V3_ECL 5N0=5N0 5P0=5P0 GND=GND VREF=NetC8_COMP_P_1
VREF_N: designators end in _VREF_N; ports 3V3_ECL=3V3_ECL 5N0=5N0 5P0=5P0 GND=GND VREF=NetC8_COMP_N_1

### Buses and harness runs
harness port VREF_CTRL = sheet VREF_DAC/DAC_CTRL

### Layout directives
net class S50: NetC8_COMP_P_1

### Notes on the sheet
- Title
- Size:
- Date:
- A4

### Library data of the parts
C79 C80 = C_100NF_16V_X5R_0402_10: as C1 on sheet Main; Part Number: C_100NF_16V_X5R_0402_10; Mount: Surface Mount; Height: 500um; HelpURL: http://datasheet.octopart.com/EMK105BJ104KV-F-Taiyo-Yuden-datasheet-8857305.pdf; RoHS: Compliant; Max Operating Temperature: 125°C; Status: MK; Supplier 1: Mouser; Supplier Part Number 1: 963-EMK105BJ104KV-F; Manufacturer 2: Samsung Electro-Mechanics; Manufacturer Part Number 2: CL05B104KO5NNNC; Supplier 2: LCSC; Supplier Part Number 2: C1525
C81 = C_1NF_50V_C0G_0402_5: Ceramic Capacitor; Manufacturer Part Number: UMK105CG102JV-F; Manufacturer: Taiyo Yuden; Value: 1nF; Tolerance: 5%; Part Number: C_1NF_50V_C0G_0402_5; Mount: Surface Mount; Height: 500um; HelpURL: https://pl.mouser.com/datasheet/2/396/mlcc02_e-1307760.pdf; RoHS: Compliant; Max Operating Temperature: 125°C; Status: AK; Supplier 1: Mouser; Supplier Part Number 1: 963-JMK212ABJ106KG-T; Manufacturer 2: Guangdong Fenghua Advanced Tech; Manufacturer Part Number 2: 0402B102K500NT; Supplier 2: LCSC; Supplier Part Number 2: C1523
DAC_OUT VREF = TP_PAD_1.3MM: Testpoint SMD 1.3mm; Part Number: TP_PAD_1.3MM; Case/Package: SMD; Length: 0mm
R45 R46 = R_2K_0402_1: Thick Film Resistor; Manufacturer: Yageo; Manufacturer Part Number: RC0402FR-072KL; Value: 2K; Tolerance: 1%; Voltage Rating (DC): 50V; Power Rating: 63mW; Stats: MK; Part Number: R_2K_0402_1; Mount: Surface Mount; Height: 350um; HelpURL: https://pl.mouser.com/datasheet/2/447/PYu-RC_Group_51_RoHS_L_10-1527934.pdf; RoHS: Compliant; Max Operating Temperature: 155°C; Supplier 1: Mouser; Supplier Part Number 1: 603-RC0402FR-072KL; Manufacturer 2: Uniroyal Elec; Manufacturer Part Number 2: 0402WGJ0202TCE; Supplier 2: LCSC; Supplier Part Number 2: C25552
R47 = R_82K_0402_1: Thisk Film Resistor; Manufacturer: Yageo; Manufacturer Part Number: RC0402FR-0782KL; Value: 82K; Tolerance: 1%; Voltage Rating (DC): 50V; Power Rating: 63mW; Stats: MK; Part Number: R_82K_0402_1; Mount: Surface Mount; Height: 350um; HelpURL: http://datasheet.octopart.com/RC0402FR-07931RL-Yageo-datasheet-10408619.pdf; RoHS: Compliant; Max Operating Temperature: 155°C; Supplier 1: Mouser; Supplier Part Number 1: 603-RC0402FR-0782KL; Manufacturer 2: Uniroyal Elec; Manufacturer Part Number 2: 0402WGF8202TCE; Supplier 2: LCSC; Supplier Part Number 2: C4142
U17 = OPA197IDR: Single Precision Rail-to-Rail Input Outpu Low Offset Voltage Op Amp; Manufacturer: Texas Instruments; Input Offset Voltage (Vos): 100uV; Max Supply Voltage: 36V; Min Supply Voltage: 4.5V; Number of Amplifiers: 1; Part Number: OPA197IDR; Manufacturer Part Number: OPA197IDR; Case/Package: SOIC8; Mount: Surface Mount; Height: 1.75mm; HelpURL: https://www.ti.com/lit/ds/symlink/opa197.pdf?ts=1615653815139; Marking: OPA197; Max Operating Temperature: 125°C; RoHS: Compliant; Supplier 1: Mouser; Supplier Part Number 1: 595-OPA197IDR

## Sheet DAC_12bit.SchDoc
size A4; ApprovedBy: Mateusz Kowalik; CheckedBy: Mateusz Kowalik; Author: Mateusz Kowalik; CompanyName: InMotion Labs sp. z o.o.; DrawnBy: Mateusz Kowalik; Engineer: Mateusz Kowalik; Organization: InMotion Labs sp. z o.o.; Address1: Rydlówka 5A; Address2: 30-363 Kraków; Address4: Poland; DocumentNumber: 3; Revision: Rev 0; SheetNumber: 10; SheetTotal: 17
Used 4 times, as channels VREF_P/VREF_DAC, PROGRAMMABLE_DELAY_LINE_MAIN/DELAY_DAC, VREF_N/VREF_DAC, PROGRAMMABLE_DELAY_LINE_STEP_GEN/DELAY_DAC. Parts and nets are listed once, with the designators drawn on the sheet.
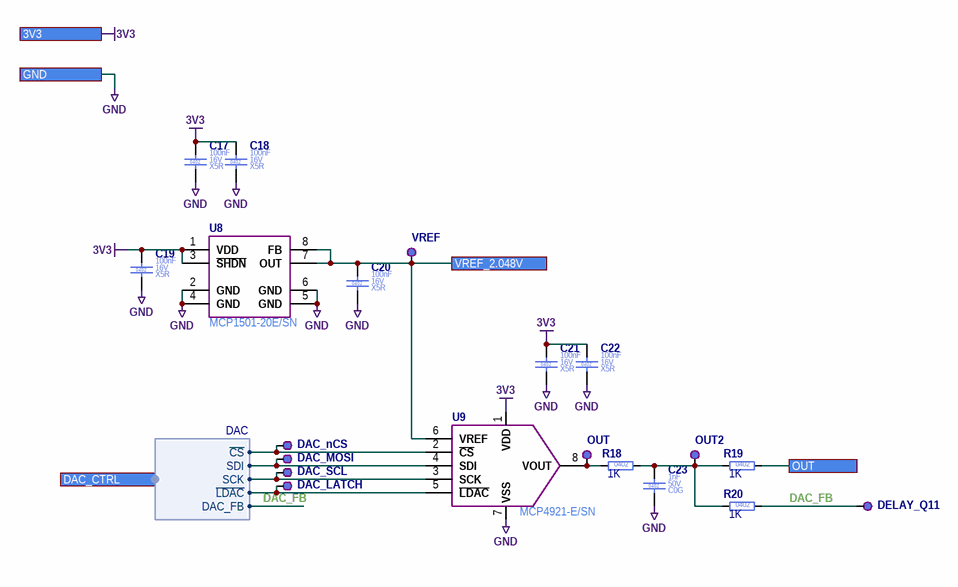
[diagram p3: DAC_12bit.SchDoc]

### Parts
C17  Case/Package: 0402  Voltage Rating (DC): 16V  Dielectric: X5R  Capacitance: 100nF  [C_0402_1005]  (hidden comment: C_100NF_16V_X5R_0402_10)
C18  Case/Package: 0402  Voltage Rating (DC): 16V  Dielectric: X5R  Capacitance: 100nF  [C_0402_1005]  (hidden comment: C_100NF_16V_X5R_0402_10)
C19  Case/Package: 0402  Voltage Rating (DC): 16V  Dielectric: X5R  Capacitance: 100nF  [C_0402_1005]  (hidden comment: C_100NF_16V_X5R_0402_10)
C20  Case/Package: 0402  Voltage Rating (DC): 16V  Dielectric: X5R  Capacitance: 100nF  [C_0402_1005]  (hidden comment: C_100NF_16V_X5R_0402_10)
C21  Case/Package: 0402  Voltage Rating (DC): 16V  Dielectric: X5R  Capacitance: 100nF  [C_0402_1005]  (hidden comment: C_100NF_16V_X5R_0402_10)
C22  Case/Package: 0402  Voltage Rating (DC): 16V  Dielectric: X5R  Capacitance: 100nF  [C_0402_1005]  (hidden comment: C_100NF_16V_X5R_0402_10)
C23  Case/Package: 0402  Voltage Rating (DC): 50V  Dielectric: C0G  Capacitance: 1nF  [C_0402_1005]  (hidden comment: C_1NF_50V_C0G_0402_5)
DAC_LATCH  TP_PAD_1.3MM  [TP_PAD_1.3MM]  (value not drawn)  (no BOM)
DAC_MOSI  TP_PAD_1.3MM  [TP_PAD_1.3MM]  (value not drawn)  (no BOM)
DAC_nCS  TP_PAD_1.3MM  [TP_PAD_1.3MM]  (value not drawn)  (no BOM)
DAC_SCL  TP_PAD_1.3MM  [TP_PAD_1.3MM]  (value not drawn)  (no BOM)
DELAY_Q11  TP_PAD_1.3MM  [TP_PAD_1.3MM]  (value not drawn)  (no BOM)
OUT  TP_PAD_1.3MM  [TP_PAD_1.3MM]  (value not drawn)  (no BOM)
OUT2  TP_PAD_1.3MM  [TP_PAD_1.3MM]  (value not drawn)  (no BOM)
R18  Resistance: 1K  Case/Package: 0402  [R_0402_1005]  (hidden comment: R_1K_0402_1)
R19  Resistance: 1K  Case/Package: 0402  [R_0402_1005]  (hidden comment: R_1K_0402_1)
R20  Resistance: 1K  Case/Package: 0402  [R_0402_1005]  (hidden comment: R_1K_0402_1)
U8  Manufacturer Part Number: MCP1501-20E/SN  [SOIC127P600X170-8N]  (hidden comment: MCP1501_SOIC)
U9  MCP4921-E/SN  [SOIC127P600X170-8N]
VREF  TP_PAD_1.3MM  [TP_PAD_1.3MM]  (value not drawn)  (no BOM)

### Ports
3V3, DAC_CTRL (harness DAC), GND, OUT, VREF_2.048V

### Harnesses
DAC: ~{CS}, SDI, SCK, ~{LDAC}, DAC_FB

### Nets
3V3: C17.1 C18.1 C19.1 C21.1 C22.1 U8.1(VDD) U8.3(~{SHDN}) U9.1(VDD) ; port 3V3
GND: C17.2 C18.2 C19.2 C20.2 C21.2 C22.2 C23.2 U8.2(GND) U8.4(GND) U8.5(GND) U8.6(GND) U9.7(VSS) ; port GND
DAC_FB: DELAY_Q11.1(TP) R20.2 ; port DAC_CTRL.DAC_FB
OUT: R19.2 ; port OUT
VREF_2.048V: C20.1 U8.7(OUT) U8.8(FB) U9.6(VREF) VREF.1(TP) ; port VREF_2.048V
NetC23_1: C23.1 OUT2.1(TP) R18.2 R19.1 R20.1
NetDAC_LATCH_1: DAC_LATCH.1(TP) U9.5(~{LDAC}) ; port DAC_CTRL.~{LDAC}
NetDAC_MOSI_1: DAC_MOSI.1(TP) U9.4(SDI) ; port DAC_CTRL.SDI
NetDAC_nCS_1: DAC_nCS.1(TP) U9.2(~{CS}) ; port DAC_CTRL.~{CS}
NetDAC_SCL_1: DAC_SCL.1(TP) U9.3(SCK) ; port DAC_CTRL.SCK
NetOUT_1: OUT.1(TP) R18.1 U9.8(VOUT)

### Channels
VREF_P/VREF_DAC: designators end in _VREF_P_VREF_DAC; ports 3V3=3V3_ECL GND=GND OUT=NetDAC_OUT_VREF_P_1 VREF_2.048V=NetC20_VREF_P_VREF_DAC_1
PROGRAMMABLE_DELAY_LINE_MAIN/DELAY_DAC: designators end in _PROGRAMMABLE_DELAY_LINE_MAIN_DELAY_DAC; ports 3V3=3V3_ECL GND=GND OUT=NetR19_PROGRAMMABLE_DELAY_LINE_MAIN_DELAY_DAC_2 VREF_2.048V=NetC20_PROGRAMMABLE_DELAY_LINE_MAIN_DELAY_DAC_1
VREF_N/VREF_DAC: designators end in _VREF_N_VREF_DAC; ports 3V3=3V3_ECL GND=GND OUT=NetDAC_OUT_VREF_N_1 VREF_2.048V=NetC20_VREF_N_VREF_DAC_1
PROGRAMMABLE_DELAY_LINE_STEP_GEN/DELAY_DAC: designators end in _PROGRAMMABLE_DELAY_LINE_STEP_GEN_DELAY_DAC; ports 3V3=3V3_ECL GND=GND OUT=NetR19_PROGRAMMABLE_DELAY_LINE_STEP_GEN_DELAY_DAC_2 VREF_2.048V=NetC20_PROGRAMMABLE_DELAY_LINE_STEP_GEN_DELAY_DAC_1

### Notes on the sheet
- Title
- Size:
- Date:
- A4

### Library data of the parts
C17-C22 = C_100NF_16V_X5R_0402_10: as C1 on sheet Main; Part Number: C_100NF_16V_X5R_0402_10; Mount: Surface Mount; Height: 500um; HelpURL: http://datasheet.octopart.com/EMK105BJ104KV-F-Taiyo-Yuden-datasheet-8857305.pdf; RoHS: Compliant; Max Operating Temperature: 125°C; Status: MK; Supplier 1: Mouser; Supplier Part Number 1: 963-EMK105BJ104KV-F; Manufacturer 2: Samsung Electro-Mechanics; Manufacturer Part Number 2: CL05B104KO5NNNC; Supplier 2: LCSC; Supplier Part Number 2: C1525
C23 = C_1NF_50V_C0G_0402_5: as C81 on sheet VREF; Part Number: C_1NF_50V_C0G_0402_5; Mount: Surface Mount; Height: 500um; HelpURL: https://pl.mouser.com/datasheet/2/396/mlcc02_e-1307760.pdf; RoHS: Compliant; Max Operating Temperature: 125°C; Status: AK; Supplier 1: Mouser; Supplier Part Number 1: 963-JMK212ABJ106KG-T; Manufacturer 2: Guangdong Fenghua Advanced Tech; Manufacturer Part Number 2: 0402B102K500NT; Supplier 2: LCSC; Supplier Part Number 2: C1523
DAC_LATCH DAC_MOSI DAC_nCS DAC_SCL DELAY_Q11 OUT OUT2 VREF = TP_PAD_1.3MM: Testpoint SMD 1.3mm; Part Number: TP_PAD_1.3MM; Case/Package: SMD; Length: 0mm
R18-R20 = R_1K_0402_1: Thick Film Resistor; Manufacturer: Yageo; Manufacturer Part Number: RC0402FR-7D1KL; Value: 1K; Tolerance: 1%; Voltage Rating (DC): 50V; Power Rating: 63mW; Stats: MK; Part Number: R_1K_0402_1; Mount: Surface Mount; Height: 350um; HelpURL: https://pl.mouser.com/datasheet/2/447/PYu-RC_Group_51_RoHS_L_10-1664068.pdf; RoHS: Compliant; Max Operating Temperature: 155°C; Supplier 1: Mouser; Supplier Part Number 1: 603-RC0402FR-7D1KL; Manufacturer 2: Uniroyal Elec; Manufacturer Part Number 2: 0402WGF1001TCE; Supplier 2: LCSC; Supplier Part Number 2: C11702
U8 = MCP1501-20E/SN: 2.048V Voltage References Precision Buffered Voltage Reference; Manufacturer: Microchip Technology; Tolerance: 0.1; Output Current: 20mA; Max Input Voltage: 5.5V; Output Type: Fixed; Reference Type: Series; Part Number: MCP1501-20E/SN; Case/Package: SOIC8; Max Output Current: 20mA; Max Output Voltage: 2.048V; Max Operating Temperature: 125°C; Min Output Voltage: 2.048V; Min Operating Temperature: -40°C; Mount: Surface Mount; Height: 1.45mm; HelpURL: https://pl.mouser.com/datasheet/2/268/20005474C-961722.pdf; Lead Free: Lead Free; Length: 2.9mm; Number of Pins: 6; Output Voltage: 2.048V; REACH SVHC: No SVHC; Reference Voltage: 2.048V; RoHS: Compliant; Width: 1.55mm; Status: MK; Supplier 1: Mouser; Supplier Part Number 1: 579-MCP1501-20E/SN
U9 = MCP4921-E/SN: 1 Channel DAC 12 bit; Manufacturer: Microchip; Polarity: Unipolar; Interface: SPI; Max Supply Voltage: 5.5; Min Supply Voltage: 2.7; Resolution: 12bit; Sampling Rate: 450kHz; Part Number: MCP4921-E/SN; Manufacturer Part Number: MCP4921-E/SN; Case/Package: SO8; Mount: Surface Mount; Height: 1.75mm; HelpURL: https://ww1.microchip.com/downloads/en/DeviceDoc/22248a.pdf; Max Operating Temperature: 125; RoHS: Compliant; Status: MK; Supplier 1: Mouser; Supplier Part Number 1: 579-MCP4921-E/SN

## Sheet Comparator-Sampler.SchDoc
size A4; ApprovedBy: Mateusz Kowalik; CheckedBy: Mateusz Kowalik; Author: Mateusz Kowalik; CompanyName: InMotion Labs sp. z o.o.; DrawnBy: Mateusz Kowalik; Engineer: Mateusz Kowalik; Organization: InMotion Labs sp. z o.o.; Address1: Rydlówka 5A; Address2: 30-363 Kraków; Address4: Poland; DocumentNumber: 2; Revision: Rev 0; SheetNumber: 2; SheetTotal: 17
Used 2 times, as channels COMP_P, COMP_N. Parts and nets are listed once, with the designators drawn on the sheet.
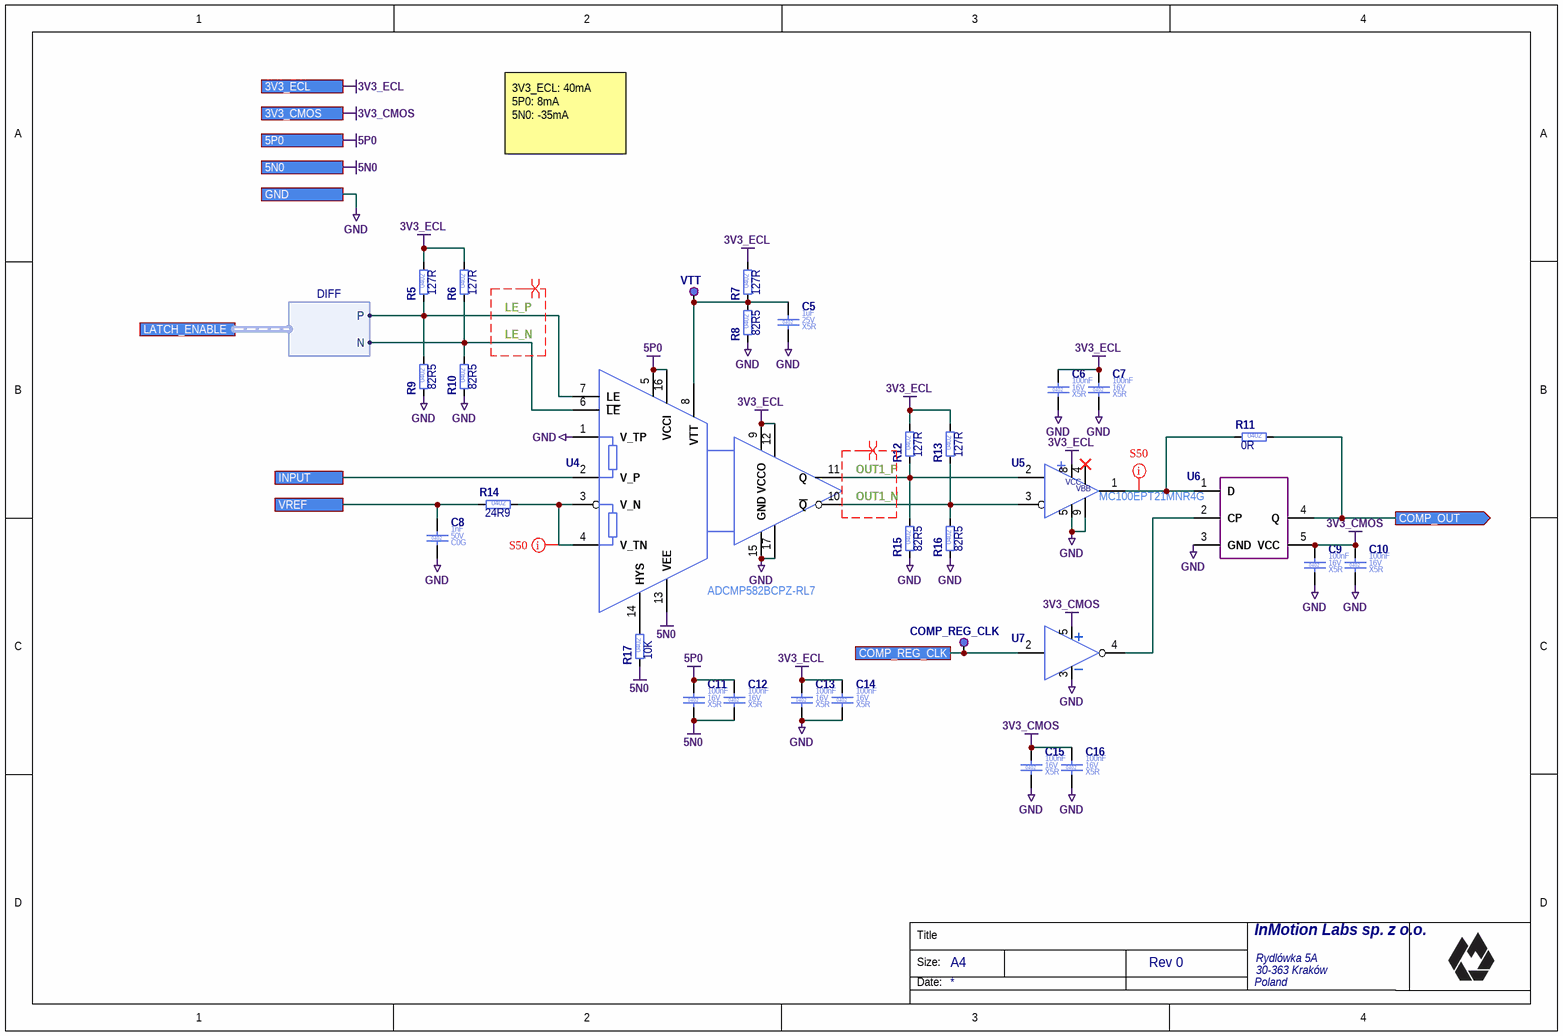
[diagram p4: Comparator-Sampler.SchDoc]

### Parts
C5  Case/Package: 0402  Voltage Rating (DC): 25V  Dielectric: X5R  Capacitance: 1uF  [C_0402_1005]  (hidden comment: C_1UF_25V_X5R_0402_10)
C6  Case/Package: 0402  Voltage Rating (DC): 16V  Dielectric: X5R  Capacitance: 100nF  [C_0402_1005]  (hidden comment: C_100NF_16V_X5R_0402_10)
C7  Case/Package: 0402  Voltage Rating (DC): 16V  Dielectric: X5R  Capacitance: 100nF  [C_0402_1005]  (hidden comment: C_100NF_16V_X5R_0402_10)
C8  Case/Package: 0402  Voltage Rating (DC): 50V  Dielectric: C0G  Capacitance: 1nF  [C_0402_1005]  (hidden comment: C_1NF_50V_C0G_0402_5)
C9  Case/Package: 0402  Voltage Rating (DC): 16V  Dielectric: X5R  Capacitance: 100nF  [C_0402_1005]  (hidden comment: C_100NF_16V_X5R_0402_10)
C10  Case/Package: 0402  Voltage Rating (DC): 16V  Dielectric: X5R  Capacitance: 100nF  [C_0402_1005]  (hidden comment: C_100NF_16V_X5R_0402_10)
C11  Case/Package: 0402  Voltage Rating (DC): 16V  Dielectric: X5R  Capacitance: 100nF  [C_0402_1005]  (hidden comment: C_100NF_16V_X5R_0402_10)
C12  Case/Package: 0402  Voltage Rating (DC): 16V  Dielectric: X5R  Capacitance: 100nF  [C_0402_1005]  (hidden comment: C_100NF_16V_X5R_0402_10)
C13  Case/Package: 0402  Voltage Rating (DC): 16V  Dielectric: X5R  Capacitance: 100nF  [C_0402_1005]  (hidden comment: C_100NF_16V_X5R_0402_10)
C14  Case/Package: 0402  Voltage Rating (DC): 16V  Dielectric: X5R  Capacitance: 100nF  [C_0402_1005]  (hidden comment: C_100NF_16V_X5R_0402_10)
C15  Case/Package: 0402  Voltage Rating (DC): 16V  Dielectric: X5R  Capacitance: 100nF  [C_0402_1005]  (hidden comment: C_100NF_16V_X5R_0402_10)
C16  Case/Package: 0402  Voltage Rating (DC): 16V  Dielectric: X5R  Capacitance: 100nF  [C_0402_1005]  (hidden comment: C_100NF_16V_X5R_0402_10)
COMP_REG_CLK  TP_PAD_1.3MM  [TP_PAD_1.3MM]  (value not drawn)  (no BOM)
R5  Resistance: 127R  Case/Package: 0402  [R_0402_1005]  (hidden comment: R_127R_0402_1)
R6  Resistance: 127R  Case/Package: 0402  [R_0402_1005]  (hidden comment: R_127R_0402_1)
R7  Resistance: 127R  Case/Package: 0402  [R_0402_1005]  (hidden comment: R_127R_0402_1)
R8  Resistance: 82R5  Case/Package: 0402  [R_0402_1005]  (hidden comment: R_82R5_0402_1)
R9  Resistance: 82R5  Case/Package: 0402  [R_0402_1005]  (hidden comment: R_82R5_0402_1)
R10  Resistance: 82R5  Case/Package: 0402  [R_0402_1005]  (hidden comment: R_82R5_0402_1)
R11  Resistance: 0R  Case/Package: 0402  [R_0402_1005]  (hidden comment: R_0R_0402_1)
R12  Resistance: 127R  Case/Package: 0402  [R_0402_1005]  (hidden comment: R_127R_0402_1)
R13  Resistance: 127R  Case/Package: 0402  [R_0402_1005]  (hidden comment: R_127R_0402_1)
R14  Resistance: 24R9  Case/Package: 0402  [R_0402_1005]  (hidden comment: R_24R9_0402_1)
R15  Resistance: 82R5  Case/Package: 0402  [R_0402_1005]  (hidden comment: R_82R5_0402_1)
R16  Resistance: 82R5  Case/Package: 0402  [R_0402_1005]  (hidden comment: R_82R5_0402_1)
R17  Resistance: 10K  Case/Package: 0402  [R_0402_1005]  (hidden comment: R_10K_0402_1)
U4  ADCMP582BCPZ-RL7  [QFN50P300X300X100_HS-17N]
U5  MC100EPT21MNR4G  [SON50P200X80_HS-9N]
U6  74LVC1G79GV,125  [SOT23-5_SC74A_SOT753_M]  (value not drawn)
U7  SN74AHC1G04DBVR  [SOT23-5_SC74A_SOT753_M]  (value not drawn)
VTT  TP_PAD_1.3MM  [TP_PAD_1.3MM]  (value not drawn)  (no BOM)

### Ports
3V3_CMOS, 3V3_ECL, 5N0, 5P0, COMP_OUT (out), COMP_REG_CLK, GND, INPUT, LATCH_ENABLE (harness DIFF), VREF

### Harnesses
DIFF: P, N

### Nets
3V3_CMOS: C9.1 C10.1 C15.1 C16.1 U6.5(VCC) U7.5(VCC) ; port 3V3_CMOS
3V3_ECL: C6.1 C7.1 C13.1 C14.1 R5.2 R6.2 R7.2 R12.2 R13.2 U4.9(VCCO) U4.12(VCCO) U5.8(VDD) ; port 3V3_ECL
5N0: C11.2 C12.2 R17.1 U4.13(VEE) ; port 5N0
5P0: C11.1 C12.1 U4.5(VCCI) U4.16(VCCI) ; port 5P0
GND: C5.2 C6.2 C7.2 C8.2 C9.2 C10.2 C13.2 C14.2 C15.2 C16.2 R8.1 R9.1 R10.1 R15.1 R16.1 U4.1(V_TP) U4.15(GND) U4.17(GND) U5.5(VSS) U5.9(VSS) U6.3(GND) U7.3(GND) ; port GND
COMP_OUT: R11.2 U6.4(Q) ; port COMP_OUT
COMP_REG_CLK: COMP_REG_CLK.1(TP) U7.2 ; port COMP_REG_CLK
INPUT: U4.2(V_P) ; port INPUT
LE_N: R6.1 R10.2 U4.6(~{LE}) ; port LATCH_ENABLE.N
LE_P: R5.1 R9.2 U4.7(LE) ; port LATCH_ENABLE.P
OUT1_N: R13.1 R16.2 U4.10(~{Q}) U5.3(~{D})  [project net OUT1_N_2]
OUT1_P: R12.1 R15.2 U4.11(Q) U5.2(D)  [project net OUT1_P_2]
VREF: C8.1 R14.1 ; port VREF
NetC5_1: C5.1 R7.1 R8.2 U4.8(VTT) VTT.1(TP)
NetR11_1: R11.1 U5.1(OUTA) U6.1(D)
NetR14_2: R14.2 U4.3(V_N) U4.4(V_TN)
NetR17_2: R17.2 U4.14(HYS)
NetU6_2: U6.2(CP) U7.4(OutY)

Not connected (* = marked no-connect by the designer): U5 4(VDD)*; U7 1(NC)

### Channels
COMP_P: designators end in _COMP_P; ports 3V3_CMOS=3V3_CMOS 3V3_ECL=3V3_ECL 5N0=5N0 5P0=5P0 COMP_OUT=COMP_OUT_N COMP_REG_CLK=COMP_REG_CLK_P GND=GND INPUT=COMP_IN_P VREF=NetC8_COMP_P_1
COMP_N: designators end in _COMP_N; ports 3V3_CMOS=3V3_CMOS 3V3_ECL=3V3_ECL 5N0=5N0 5P0=5P0 COMP_OUT=COMP_OUT_P COMP_REG_CLK=COMP_REG_CLK_N GND=GND INPUT=COMP_IN_N VREF=NetC8_COMP_N_1

### Layout directives
net class S50: NetR11_COMP_P_1, NetR14_COMP_P_2
differential pair; differential pair class D100; net class D100: LE_N, LE_P, OUT1_N, OUT1_P

### Notes on the sheet
- 3V3_ECL: 40mA
  5P0: 8mA
  5N0: -35mA
- Title
- Size:
- Date:
- A4
- (in symbol MC100EPT21MNR4G) VCC; VBB

### Library data of the parts
C5 = C_1UF_25V_X5R_0402_10: Ceramic Capacitor; Manufacturer Part Number: CL05A105KA5NQNC; Manufacturer: Samsung Electro-Mechanics; Value: 1uF; Tolerance: 10%; Part Number: C_1UF_25V_X5R_0402_10; Mount: Surface Mount; Height: 550um; HelpURL: https://pl.mouser.com/datasheet/2/585/MLCC-1837944.pdf; RoHS: Compliant; Max Operating Temperature: 85°C; Status: MK; Supplier 1: Mouser; Supplier Part Number 1: 187-CL05A105KA5NQNC; Manufacturer 2: Samsung Electro-Mechanics; Manufacturer Part Number 2: CL05A105KA5NQNC; Supplier 2: LCSC; Supplier Part Number 2: C52923
C6 C7 C9-C16 = C_100NF_16V_X5R_0402_10: as C1 on sheet Main; Part Number: C_100NF_16V_X5R_0402_10; Mount: Surface Mount; Height: 500um; HelpURL: http://datasheet.octopart.com/EMK105BJ104KV-F-Taiyo-Yuden-datasheet-8857305.pdf; RoHS: Compliant; Max Operating Temperature: 125°C; Status: MK; Supplier 1: Mouser; Supplier Part Number 1: 963-EMK105BJ104KV-F; Manufacturer 2: Samsung Electro-Mechanics; Manufacturer Part Number 2: CL05B104KO5NNNC; Supplier 2: LCSC; Supplier Part Number 2: C1525
C8 = C_1NF_50V_C0G_0402_5: as C81 on sheet VREF; Part Number: C_1NF_50V_C0G_0402_5; Mount: Surface Mount; Height: 500um; HelpURL: https://pl.mouser.com/datasheet/2/396/mlcc02_e-1307760.pdf; RoHS: Compliant; Max Operating Temperature: 125°C; Status: AK; Supplier 1: Mouser; Supplier Part Number 1: 963-JMK212ABJ106KG-T; Manufacturer 2: Guangdong Fenghua Advanced Tech; Manufacturer Part Number 2: 0402B102K500NT; Supplier 2: LCSC; Supplier Part Number 2: C1523
COMP_REG_CLK VTT = TP_PAD_1.3MM: Testpoint SMD 1.3mm; Part Number: TP_PAD_1.3MM; Case/Package: SMD; Length: 0mm
R5-R7 R12 R13 = R_127R_0402_1: as R1 on sheet Main; Part Number: R_127R_0402_1; Mount: Surface Mount; Height: 350um; HelpURL: https://pl.mouser.com/datasheet/2/447/PYu_RC_Group_51_RoHS_L_10-1664068.pdf; RoHS: Compliant; Max Operating Temperature: 155°C; Supplier 1: Mouser; Supplier Part Number 1: 603-RC0402FR-07127RL; Manufacturer 2: Uniroyal Elec; Manufacturer Part Number 2: 0402WGF1270TCE; Supplier 2: LCSC; Supplier Part Number 2: C247127
R8-R10 R15 R16 = R_82R5_0402_1: as R3 on sheet Main; Part Number: R_82R5_0402_1; Mount: Surface Mount; Height: 350um; HelpURL: https://pl.mouser.com/datasheet/2/447/PYu-RC_Group_51_RoHS_L_10-1527934.pdf; RoHS: Compliant; Max Operating Temperature: 155°C; Supplier 1: Mouser; Supplier Part Number 1: 603-RC0402FR-0782R5L; Manufacturer 2: Uniroyal Elec; Manufacturer Part Number 2: 0402WGF825JTCE; Supplier 2: LCSC; Supplier Part Number 2: C52037
R11 = R_0R_0402_1: Thick Film Resistor; Manufacturer: Yageo; Manufacturer Part Number: RC0402FR-070RL; Value: 0R; Tolerance: 1%; Voltage Rating (DC): 50V; Power Rating: 63mW; Stats: MK; Part Number: R_0R_0402_1; Mount: Surface Mount; Height: 350um; HelpURL: http://datasheet.octopart.com/2176049-1-TE-Connectivity---AMP-datasheet-11120217.pdf; RoHS: Compliant; Max Operating Temperature: 155°C; Supplier 1: Mouser; Supplier Part Number 1: 603-RC0402FR-070RL; Manufacturer 2: Uniroyal Elec; Manufacturer Part Number 2: 0402WGF0000TCE; Supplier 2: LCSC; Supplier Part Number 2: C17168
R14 = R_24R9_0402_1: Thick Film Resistor; Manufacturer: Yageo; Manufacturer Part Number: RC0402FR-0724R9L; Value: 24R9; Tolerance: 1%; Voltage Rating (DC): 50V; Power Rating: 63mW; Stats: MK; Part Number: R_24R9_0402_1; Mount: Surface Mount; Height: 350um; HelpURL: http://datasheet.octopart.com/RC0402FR-07825KL-Yageo-datasheet-127823281.pdf; RoHS: Compliant; Max Operating Temperature: 155°C; Supplier 1: Mouser; Supplier Part Number 1: 603-RC0402FR-0724R9L; Manufacturer 2: Uniroyal Elec; Manufacturer Part Number 2: 0402WGF249JTCE; Supplier 2: LCSC; Supplier Part Number 2: C5099
R17 = R_10K_0402_1: Thick Film Resistor; Manufacturer: Yageo; Manufacturer Part Number: RC0402FR-7W10KL; Value: 10K; Tolerance: 1%; Voltage Rating (DC): 50V; Power Rating: 63mW; Stats: MK; Part Number: R_10K_0402_1; Mount: Surface Mount; Height: 350um; HelpURL: https://pl.mouser.com/datasheet/2/447/PYu-RC_Group_51_RoHS_L_10-1664068.pdf; RoHS: Compliant; Max Operating Temperature: 155°C; Supplier 1: Mouser; Supplier Part Number 1: 603-RC0402FR-7W10KL; Manufacturer 2: Uniroyal Elec; Manufacturer Part Number 2: 0402WGF1002TCE; Supplier 2: LCSC; Supplier Part Number 2: C25744
U4 = ADCMP582BCPZ-RL7: Single Comparator; Manufacturer: Analog Devices; Number of Comparators: 1; Response Time: 180ps; Input Offset Voltage: 4mV; Marking: G10; Max Supply Voltage: 5.5V; Min Supply Voltage: 4.5V; Part Number: ADCMP582BCPZ-RL7; Manufacturer Part Number: ADCMP582BCPZ-RL7; Case/Package: QFN14; Mount: Surface Mount; Height: 0.8mm; Max Operating Temperature: 125; HelpURL: https://www.analog.com/media/en/technical-documentation/data-sheets/ADCMP580_581_582.pdf; Number of Pins: 16; RoHS: Compliant
U5 = MC100EPT21MNR4G: as U2 on sheet Main; Part Number: MC100EPT21MNR4G; Case/Package: DFN-8; Max Output Current: 24mA; Mount: Surface Mount; Height: 1mm; HelpURL: https://datasheet.octopart.com/MC100EPT21MNR4G-ON-Semiconductor-datasheet-12520234.pdf; Max Operating Temperature: 85°C; RoHS: Compliant; Status: MK; Manufacturer Part Number: MC100EPT21MNR4G; Supplier 1: Mouser; Supplier Part Number 1: 863-MC100EPT21MNR4G
U6 = 74LVC1G79GV,125: D Flip Flop Positive Edge Trigger; Manufacturer: Nexperia; Output Current: 32mA; Marking: V79; Max Supply Voltage: 5.5V; Min Supply Voltage: 1.65V; Part Number: 74LVC1G79GV,125; Case/Package: SOT-573; Max Output Current: 32mA; Mount: Surface Mount; Height: 1.1mm; HelpURL: https://datasheet.octopart.com/74LVC1G79GV%2C125-Nexperia-datasheet-87580644.pdf; Max Operating Temperature: 125°C; RoHS: Compliant; Status: MK; Manufacturer Part Number: 74LVC1G79GV,125; Supplier 1: Mouser; Supplier Part Number 1: 771-LVC1G79GV125
U7 = SN74AHC1G04DBVR: Inverters Single; Manufacturer: Texas Instruments; Output Current: 25mA; Max Output Current: 50mA; Max Supply Voltage: 5.5V; Min Supply Voltage: 2V; Part Number: SN74AHC1G04DBVR; Case/Package: SOT-23; Mount: Surface Mount; Height: 1.1mm; HelpURL: http://www.ti.com/lit/ds/symlink/sn74ahc1g04.pdf; Max Operating Temperature: 125°C; RoHS: Compliant; Status: AK; Manufacturer Part Number: SN74AHC1G04DBVR